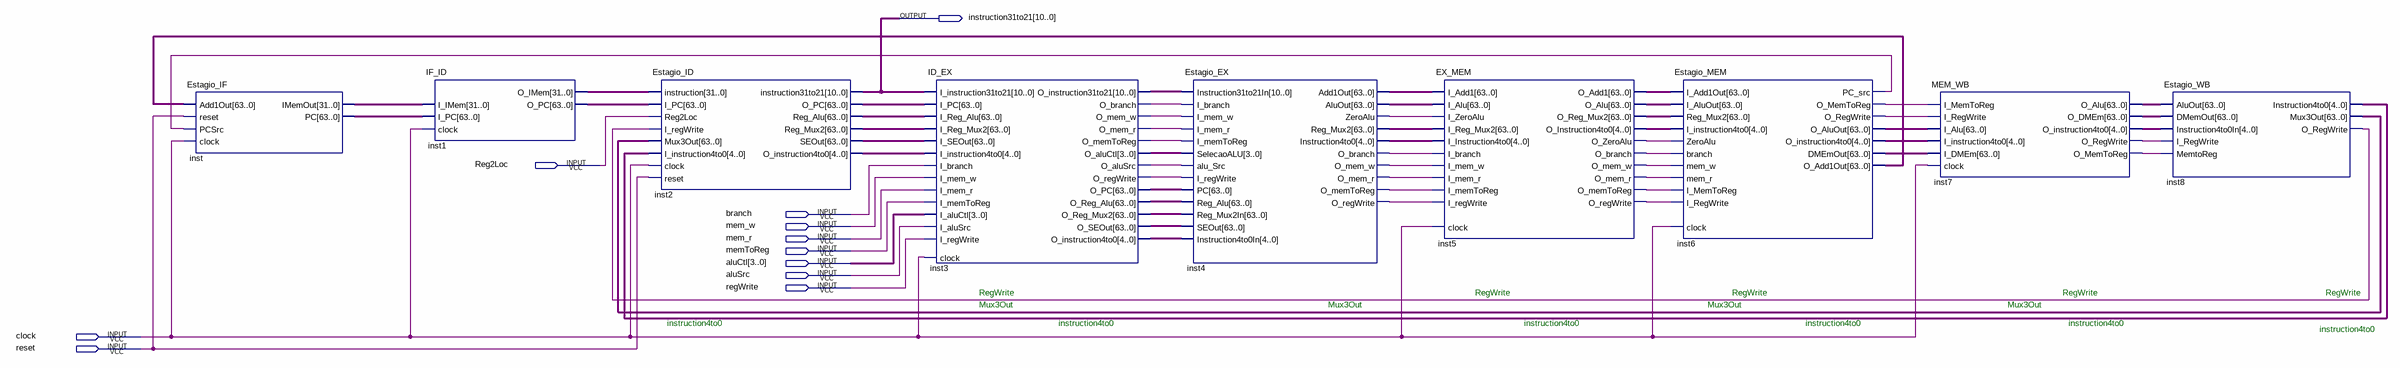
[diagram p0: schematic sheet]
// Quartus schematic blocos_FD.bdf as structural Verilog: 9 symbols, 11 pins
module blocos_FD (
  input  Reg2Loc,
  input  branch,
  input  mem_w,
  input  mem_r,
  input  memToReg,
  input  [3:0] aluCtl,
  input  aluSrc,
  input  regWrite,
  input  clock,
  input  reset,
  output [10:0] instruction31to21
);

  wire inst3_o_alusrc, inst3_o_branch, inst3_o_mem_r, inst3_o_mem_w, inst3_o_memtoreg, inst3_o_regwrite,
       inst4_o_branch, inst4_o_mem_r, inst4_o_mem_w, inst4_o_memtoreg, inst4_o_regwrite, inst4_zeroalu,
       inst5_o_branch, inst5_o_mem_r, inst5_o_mem_w, inst5_o_memtoreg, inst5_o_regwrite, inst5_o_zeroalu,
       inst6_o_memtoreg, inst6_o_regwrite, inst6_pc_src, inst7_o_memtoreg, inst7_o_regwrite, inst8_o_regwrite;
  wire [3:0] inst3_o_aluctl;
  wire [4:0] inst2_o_instruction4to0, inst3_o_instruction4to0, inst4_instruction4to0,
       inst5_o_instruction4to0, inst6_o_instruction4to0, inst7_o_instruction4to0, inst8_instruction4to0;
  wire [10:0] inst3_o_instruction31to21;
  wire [31:0] inst1_o_imem, inst_imemout;
  wire [63:0] inst1_o_pc, inst2_o_pc, inst2_reg_alu, inst2_reg_mux2, inst2_seout, inst3_o_pc,
       inst3_o_reg_alu, inst3_o_reg_mux2, inst3_o_seout, inst4_add1out, inst4_aluout, inst4_reg_mux2,
       inst5_o_add1, inst5_o_alu, inst5_o_reg_mux2, inst6_dmemout, inst6_o_add1out, inst6_o_aluout,
       inst7_o_alu, inst7_o_dmem, inst8_mux3out, inst_pc;

  Estagio_IF inst (
    .clock(clock), .reset(reset), .PCSrc(inst6_pc_src), .Add1Out(inst6_o_add1out), .IMemOut(inst_imemout),
    .PC(inst_pc));
  IF_ID inst1 (.clock(clock), .I_IMem(inst_imemout), .I_PC(inst_pc), .O_IMem(inst1_o_imem), .O_PC(inst1_o_pc));
  Estagio_ID inst2 (
    .clock(clock), .reset(reset), .Reg2Loc(Reg2Loc), .I_regWrite(inst8_o_regwrite), .I_PC(inst1_o_pc),
    .instruction(inst1_o_imem), .Mux3Out(inst8_mux3out), .I_instruction4to0(inst8_instruction4to0),
    .instruction31to21(instruction31to21), .O_PC(inst2_o_pc), .Reg_Alu(inst2_reg_alu),
    .Reg_Mux2(inst2_reg_mux2), .SEOut(inst2_seout), .O_instruction4to0(inst2_o_instruction4to0));
  ID_EX inst3 (
    .clock(clock), .I_branch(branch), .I_mem_w(mem_w), .I_mem_r(mem_r), .I_memToReg(memToReg),
    .I_aluCtl(aluCtl), .I_aluSrc(aluSrc), .I_regWrite(regWrite), .I_instruction31to21(instruction31to21),
    .I_PC(inst2_o_pc), .I_Reg_Alu(inst2_reg_alu), .I_Reg_Mux2(inst2_reg_mux2), .I_SEOut(inst2_seout),
    .I_instruction4to0(inst2_o_instruction4to0), .O_branch(inst3_o_branch), .O_mem_w(inst3_o_mem_w),
    .O_mem_r(inst3_o_mem_r), .O_memToReg(inst3_o_memtoreg), .O_aluCtl(inst3_o_aluctl),
    .O_aluSrc(inst3_o_alusrc), .O_regWrite(inst3_o_regwrite),
    .O_instruction31to21(inst3_o_instruction31to21), .O_PC(inst3_o_pc), .O_Reg_Alu(inst3_o_reg_alu),
    .O_Reg_Mux2(inst3_o_reg_mux2), .O_SEOut(inst3_o_seout), .O_instruction4to0(inst3_o_instruction4to0));
  Estagio_EX inst4 (
    .PC(inst3_o_pc), .Reg_Alu(inst3_o_reg_alu), .Reg_Mux2In(inst3_o_reg_mux2), .SEOut(inst3_o_seout),
    .Instruction31to21In(inst3_o_instruction31to21), .Instruction4to0In(inst3_o_instruction4to0),
    .SelecaoALU(inst3_o_aluctl), .alu_Src(inst3_o_alusrc), .I_branch(inst3_o_branch),
    .I_mem_w(inst3_o_mem_w), .I_mem_r(inst3_o_mem_r), .I_memToReg(inst3_o_memtoreg),
    .I_regWrite(inst3_o_regwrite), .Add1Out(inst4_add1out), .AluOut(inst4_aluout), .ZeroAlu(inst4_zeroalu),
    .Reg_Mux2(inst4_reg_mux2), .Instruction4to0(inst4_instruction4to0), .O_branch(inst4_o_branch),
    .O_mem_w(inst4_o_mem_w), .O_mem_r(inst4_o_mem_r), .O_memToReg(inst4_o_memtoreg),
    .O_regWrite(inst4_o_regwrite));
  EX_MEM inst5 (
    .clock(clock), .I_Add1(inst4_add1out), .I_Alu(inst4_aluout), .I_Reg_Mux2(inst4_reg_mux2),
    .I_Instruction4to0(inst4_instruction4to0), .I_ZeroAlu(inst4_zeroalu), .I_branch(inst4_o_branch),
    .I_mem_w(inst4_o_mem_w), .I_mem_r(inst4_o_mem_r), .I_memToReg(inst4_o_memtoreg),
    .I_regWrite(inst4_o_regwrite), .O_Add1(inst5_o_add1), .O_Alu(inst5_o_alu), .O_Reg_Mux2(inst5_o_reg_mux2),
    .O_Instruction4to0(inst5_o_instruction4to0), .O_ZeroAlu(inst5_o_zeroalu), .O_branch(inst5_o_branch),
    .O_mem_w(inst5_o_mem_w), .O_mem_r(inst5_o_mem_r), .O_memToReg(inst5_o_memtoreg),
    .O_regWrite(inst5_o_regwrite));
  Estagio_MEM inst6 (
    .clock(clock), .mem_w(inst5_o_mem_w), .mem_r(inst5_o_mem_r), .branch(inst5_o_branch),
    .I_RegWrite(inst5_o_regwrite), .I_MemToReg(inst5_o_memtoreg), .I_AluOut(inst5_o_alu),
    .Reg_Mux2(inst5_o_reg_mux2), .ZeroAlu(inst5_o_zeroalu), .I_Add1Out(inst5_o_add1),
    .I_instruction4to0(inst5_o_instruction4to0), .PC_src(inst6_pc_src), .O_MemToReg(inst6_o_memtoreg),
    .O_RegWrite(inst6_o_regwrite), .O_AluOut(inst6_o_aluout), .O_instruction4to0(inst6_o_instruction4to0),
    .DMEmOut(inst6_dmemout), .O_Add1Out(inst6_o_add1out));
  MEM_WB inst7 (
    .clock(clock), .I_Alu(inst6_o_aluout), .I_DMEm(inst6_dmemout),
    .I_instruction4to0(inst6_o_instruction4to0), .I_RegWrite(inst6_o_regwrite),
    .I_MemToReg(inst6_o_memtoreg), .O_Alu(inst7_o_alu), .O_DMEm(inst7_o_dmem),
    .O_instruction4to0(inst7_o_instruction4to0), .O_RegWrite(inst7_o_regwrite), .O_MemToReg(inst7_o_memtoreg));
  Estagio_WB inst8 (
    .AluOut(inst7_o_alu), .DMemOut(inst7_o_dmem), .Instruction4to0In(inst7_o_instruction4to0),
    .MemtoReg(inst7_o_memtoreg), .I_RegWrite(inst7_o_regwrite), .Instruction4to0(inst8_instruction4to0),
    .Mux3Out(inst8_mux3out), .O_RegWrite(inst8_o_regwrite));

  // Notes on the sheet:
  //   RegWrite
  //   RegWrite
  //   RegWrite
  //   RegWrite
  //   RegWrite
  //   Mux3Out
  //   Mux3Out
  //   Mux3Out
  //   Mux3Out
  //   instruction4to0
  //   instruction4to0
  //   instruction4to0
  //   instruction4to0
  //   instruction4to0
  //   instruction4to0
endmodule
